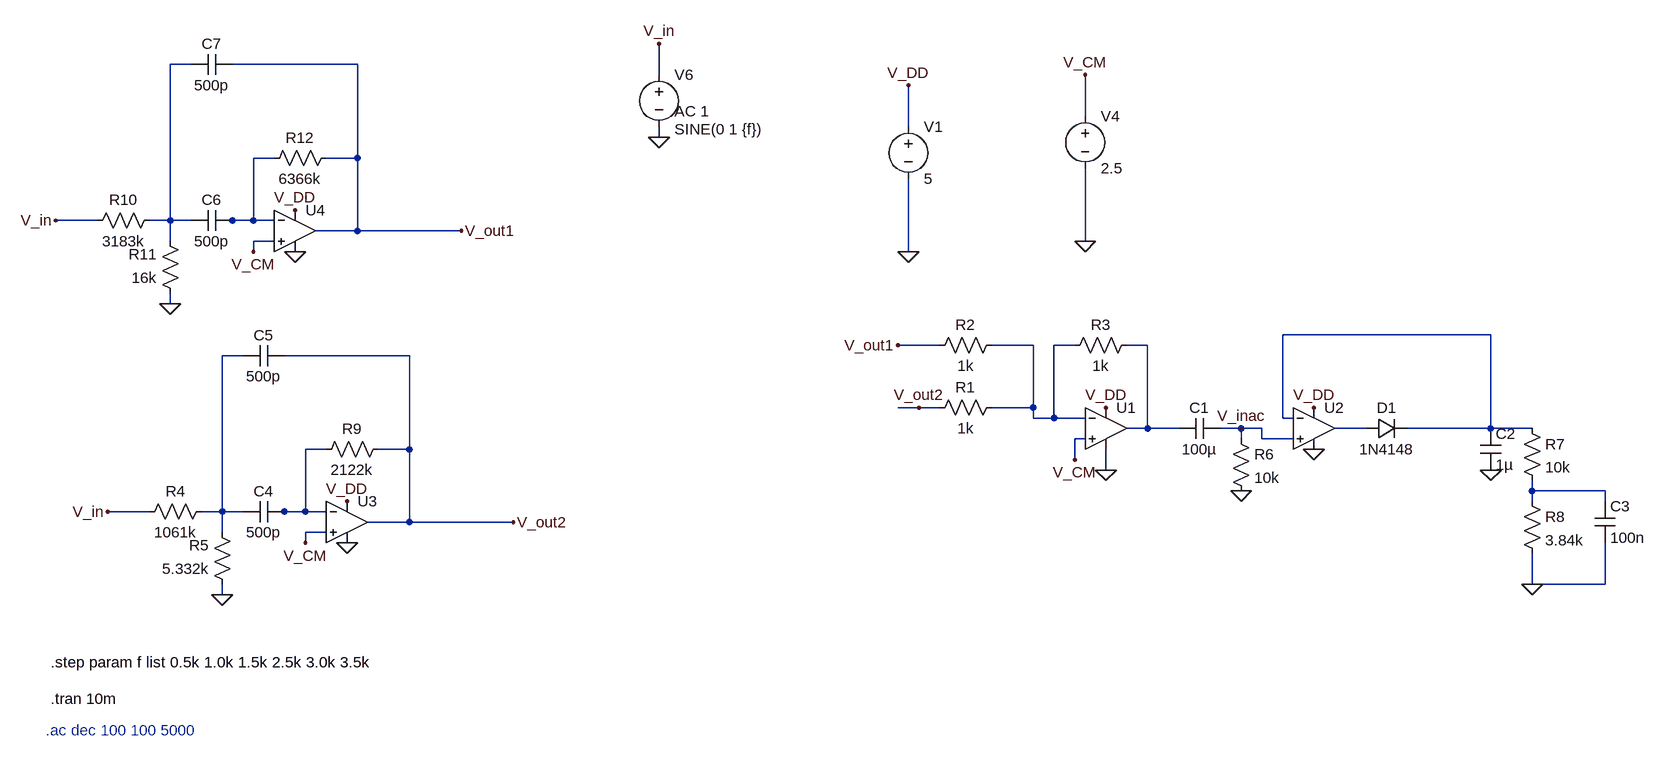
[diagram p0: schematic PeakDetect.asc]
PeakDetect.asc, the LTspice schematic file:
Version 4
SHEET 1 1876 680
WIRE -1264 -432 -1296 -432
WIRE -1008 -432 -1200 -432
WIRE -544 -416 -544 -464
WIRE 112 -352 112 -416
WIRE -160 -336 -160 -400
WIRE -544 -320 -544 -336
WIRE -1136 -288 -1168 -288
WIRE -1008 -288 -1008 -432
WIRE -1008 -288 -1056 -288
WIRE -1408 -192 -1472 -192
WIRE -1296 -192 -1296 -432
WIRE -1296 -192 -1328 -192
WIRE -1264 -192 -1296 -192
WIRE -1200 -192 -1216 -192
WIRE -1168 -192 -1168 -288
WIRE -1168 -192 -1200 -192
WIRE -1136 -192 -1168 -192
WIRE -1008 -176 -1008 -288
WIRE -1008 -176 -1072 -176
WIRE -848 -176 -1008 -176
WIRE -1296 -160 -1296 -192
WIRE -1136 -160 -1168 -160
WIRE 112 -160 112 -272
WIRE -1168 -144 -1168 -160
WIRE -160 -144 -160 -256
WIRE -1296 -64 -1296 -80
WIRE 736 -16 416 -16
WIRE -112 0 -176 0
WIRE 32 0 -32 0
WIRE 96 0 64 0
WIRE 208 0 176 0
WIRE -1184 16 -1216 16
WIRE -928 16 -1120 16
WIRE -144 96 -176 96
WIRE -112 96 -144 96
WIRE 32 96 32 0
WIRE 32 96 -32 96
WIRE 32 112 32 96
WIRE 64 112 64 0
WIRE 64 112 32 112
WIRE 112 112 64 112
WIRE 416 112 416 -16
WIRE 432 112 416 112
WIRE 208 128 208 0
WIRE 208 128 176 128
WIRE 256 128 208 128
WIRE 352 128 320 128
WIRE 384 128 352 128
WIRE 544 128 496 128
WIRE 736 128 736 -16
WIRE 736 128 608 128
WIRE 800 128 736 128
WIRE 112 144 96 144
WIRE 352 144 352 128
WIRE 384 144 384 128
WIRE 432 144 384 144
WIRE -1056 160 -1088 160
WIRE -928 160 -928 16
WIRE -928 160 -976 160
WIRE 96 176 96 144
WIRE 144 192 144 160
WIRE 800 224 800 208
WIRE 912 224 800 224
WIRE 800 240 800 224
WIRE 912 240 912 224
WIRE -1328 256 -1392 256
WIRE -1216 256 -1216 16
WIRE -1216 256 -1248 256
WIRE -1184 256 -1216 256
WIRE -1120 256 -1136 256
WIRE -1088 256 -1088 160
WIRE -1088 256 -1120 256
WIRE -1056 256 -1088 256
WIRE -928 272 -928 160
WIRE -928 272 -992 272
WIRE -768 272 -928 272
WIRE -1216 288 -1216 256
WIRE -1056 288 -1088 288
WIRE -1088 304 -1088 288
WIRE 800 368 800 320
WIRE 912 368 912 304
WIRE 912 368 800 368
WIRE -1216 384 -1216 368
FLAG 144 192 0
FLAG -160 -144 0
FLAG -160 -400 V_DD
FLAG 96 176 V_CM
FLAG 144 96 V_DD
FLAG 352 224 0
FLAG 800 368 0
FLAG 464 96 V_DD
FLAG 464 160 0
FLAG 736 192 0
FLAG 352 128 V_inac
FLAG 112 -160 0
FLAG 112 -416 V_CM
FLAG -1216 384 0
FLAG -1024 240 V_DD
FLAG -1088 304 V_CM
FLAG -1024 304 0
FLAG -768 272 V_out2
FLAG -1392 256 V_in
FLAG -1296 -64 0
FLAG -1104 -208 V_DD
FLAG -1168 -144 V_CM
FLAG -1104 -144 0
FLAG -848 -176 V_out1
FLAG -1472 -192 V_in
FLAG -544 -320 0
FLAG -544 -464 V_in
FLAG -176 0 V_out1
FLAG -144 96 V_out2
SYMBOL res -16 80 R90
WINDOW 0 0 56 VBottom 2
WINDOW 3 32 56 VTop 2
SYMATTR InstName R1
SYMATTR Value 1k
SYMBOL res -16 -16 R90
WINDOW 0 0 56 VBottom 2
WINDOW 3 32 56 VTop 2
SYMATTR InstName R2
SYMATTR Value 1k
SYMBOL res 192 -16 R90
WINDOW 0 0 56 VBottom 2
WINDOW 3 32 56 VTop 2
SYMATTR InstName R3
SYMATTR Value 1k
SYMBOL voltage -160 -352 R0
WINDOW 123 0 0 Left 0
WINDOW 39 0 0 Left 0
SYMATTR InstName V1
SYMATTR Value 5
SYMBOL cap 320 112 R90
WINDOW 0 0 32 VBottom 2
WINDOW 3 32 32 VTop 2
SYMATTR InstName C1
SYMATTR Value 100µ
SYMBOL res 336 128 R0
SYMATTR InstName R6
SYMATTR Value 10k
SYMBOL diode 544 144 R270
WINDOW 0 32 32 VTop 2
WINDOW 3 0 32 VBottom 2
SYMATTR InstName D1
SYMATTR Value 1N4148
SYMBOL cap 720 128 R0
SYMATTR InstName C2
SYMATTR Value 1µ
SYMBOL res 784 112 R0
SYMATTR InstName R7
SYMATTR Value 10k
SYMBOL res 784 224 R0
SYMATTR InstName R8
SYMATTR Value 3.84k
SYMBOL cap 896 240 R0
SYMATTR InstName C3
SYMATTR Value 100n
SYMBOL Opamps\\UniversalOpamp2 144 128 R0
SYMATTR InstName U1
SYMBOL Opamps\\UniversalOpamp2 464 128 R0
SYMATTR InstName U2
SYMBOL voltage 112 -368 R0
WINDOW 123 0 0 Left 0
WINDOW 39 0 0 Left 0
SYMATTR InstName V4
SYMATTR Value 2.5
SYMBOL res -1232 240 R90
WINDOW 0 0 56 VBottom 2
WINDOW 3 32 56 VTop 2
SYMATTR InstName R4
SYMATTR Value 1061k
SYMBOL res -1200 384 R180
WINDOW 0 36 76 Left 2
WINDOW 3 36 40 Left 2
SYMATTR InstName R5
SYMATTR Value 5.332k
SYMBOL res -1072 176 R270
WINDOW 0 32 56 VTop 2
WINDOW 3 0 56 VBottom 2
SYMATTR InstName R9
SYMATTR Value 2122k
SYMBOL cap -1120 240 R90
WINDOW 0 0 32 VBottom 2
WINDOW 3 32 32 VTop 2
SYMATTR InstName C4
SYMATTR Value 500p
SYMBOL cap -1120 0 R90
WINDOW 0 0 32 VBottom 2
WINDOW 3 32 32 VTop 2
SYMATTR InstName C5
SYMATTR Value 500p
SYMBOL Opamps\\UniversalOpamp2 -1024 272 R0
SYMATTR InstName U3
SYMBOL res -1312 -208 R90
WINDOW 0 0 56 VBottom 2
WINDOW 3 32 56 VTop 2
SYMATTR InstName R10
SYMATTR Value 3183k
SYMBOL res -1280 -64 R180
WINDOW 0 36 76 Left 2
WINDOW 3 36 40 Left 2
SYMATTR InstName R11
SYMATTR Value 16k
SYMBOL res -1152 -272 R270
WINDOW 0 32 56 VTop 2
WINDOW 3 0 56 VBottom 2
SYMATTR InstName R12
SYMATTR Value 6366k
SYMBOL cap -1200 -208 R90
WINDOW 0 0 32 VBottom 2
WINDOW 3 32 32 VTop 2
SYMATTR InstName C6
SYMATTR Value 500p
SYMBOL cap -1200 -448 R90
WINDOW 0 0 32 VBottom 2
WINDOW 3 32 32 VTop 2
SYMATTR InstName C7
SYMATTR Value 500p
SYMBOL voltage -544 -432 R0
WINDOW 3 24 100 Left 2
WINDOW 123 24 72 Left 2
WINDOW 39 0 0 Left 0
SYMATTR Value SINE(0 1 {f})
SYMATTR Value2 AC 1
SYMATTR InstName V6
SYMBOL Opamps\\UniversalOpamp2 -1104 -176 R0
SYMATTR InstName U4
TEXT -1480 544 Left 2 !.tran 10m
TEXT -1488 592 Left 2 ;.ac dec 100 100 5000
TEXT -1480 488 Left 2 !.step param f list 0.5k 1.0k 1.5k 2.5k 3.0k 3.5k

The netlist it stands for:
* PeakDetect.asc
R1 N004 V_out2 1k
R2 N004 V_out1 1k
R3 N005 N004 1k
V1 V_DD 0 5
C1 V_inac N005 100µ
R6 V_inac 0 10k
D1 N007 N003 1N4148
C2 N003 0 1µ
R7 N003 N009 10k
R8 N009 0 3.84k
C3 N009 0 100n
XU1 V_CM N004 V_DD 0 N005 level.2 Avol=1Meg GBW=10Meg Slew=10Meg ilimit=25m rail=0 Vos=0 phimargin=45 en=0 enk=0 in=0 ink=0 Rin=500Meg  ; pins IN+ IN- V+ V- OUT
XU2 V_inac N003 V_DD 0 N007 level.2 Avol=1Meg GBW=10Meg Slew=10Meg ilimit=25m rail=0 Vos=0 phimargin=45 en=0 enk=0 in=0 ink=0 Rin=500Meg  ; pins IN+ IN- V+ V- OUT
V4 V_CM 0 2.5
R4 N006 V_in 1061k
R5 0 N006 5.332k
R9 N008 V_out2 2122k
C4 N008 N006 500p
C5 V_out2 N006 500p
XU3 V_CM N008 V_DD 0 V_out2 level.2 Avol=1Meg GBW=10Meg Slew=10Meg ilimit=25m rail=0 Vos=0 phimargin=45 en=0 enk=0 in=0 ink=0 Rin=500Meg  ; pins IN+ IN- V+ V- OUT
R10 N001 V_in 3183k
R11 0 N001 16k
R12 N002 V_out1 6366k
C6 N002 N001 500p
C7 V_out1 N001 500p
V6 V_in 0 SINE(0 1 {f}) AC 1
XU4 V_CM N002 V_DD 0 V_out1 level.2 Avol=1Meg GBW=10Meg Slew=10Meg ilimit=25m rail=0 Vos=0 phimargin=45 en=0 enk=0 in=0 ink=0 Rin=500Meg  ; pins IN+ IN- V+ V- OUT
.model D D
.lib standard.dio
.tran 10m
* .ac dec 100 100 5000
.step param f list 0.5k 1.0k 1.5k 2.5k 3.0k 3.5k
.lib UniversalOpamps2.sub
.backanno
.end